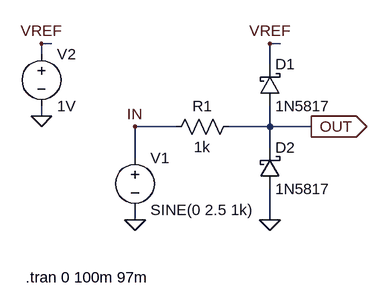
[diagram p0: schematic Limiter_Schottky.asc]
Limiter_Schottky.asc, the LTspice schematic file:
Version 4
SHEET 1 880 680
WIRE -16 -64 -32 -64
WIRE 336 -64 320 -64
WIRE -32 -48 -32 -64
WIRE 320 -32 320 -64
WIRE -32 48 -32 32
WIRE 176 64 112 64
WIRE 320 64 320 32
WIRE 320 64 256 64
WIRE 384 64 320 64
WIRE 320 96 320 64
WIRE 112 112 112 64
WIRE 112 208 112 192
WIRE 320 208 320 160
FLAG 112 208 0
FLAG 320 208 0
FLAG 320 -64 VREF
FLAG 384 64 OUT
IOPIN 384 64 Out
FLAG -32 -64 VREF
FLAG -32 48 0
FLAG 112 64 IN
SYMBOL voltage 112 96 R0
WINDOW 123 0 0 Left 2
WINDOW 39 0 0 Left 2
SYMATTR InstName V1
SYMATTR Value SINE(0 2.5 1k)
SYMBOL res 272 48 R90
WINDOW 0 0 56 VBottom 2
WINDOW 3 32 56 VTop 2
SYMATTR InstName R1
SYMATTR Value 1k
SYMBOL voltage -32 -64 R0
WINDOW 123 0 0 Left 2
WINDOW 39 0 0 Left 2
SYMATTR InstName V2
SYMATTR Value 1V
SYMBOL schottky 304 32 M180
WINDOW 0 24 64 Left 2
WINDOW 3 24 0 Left 2
SYMATTR InstName D1
SYMATTR Value 1N5817
SYMBOL schottky 304 160 M180
WINDOW 0 24 64 Left 2
WINDOW 3 24 0 Left 2
SYMATTR InstName D2
SYMATTR Value 1N5817
TEXT -56 296 Left 2 !.tran 0 100m 97m

The netlist it stands for:
* Limiter_Schottky.asc
V1 IN 0 SINE(0 2.5 1k)
R1 OUT IN 1k
V2 VREF 0 1V
D1 OUT VREF 1N5817
D2 0 OUT 1N5817
.model D D
.lib standard.dio
.tran 0 100m 97m
.backanno
.end